# EAGLE design TLC5940Shield-v1 (EAGLE 6.5.0)
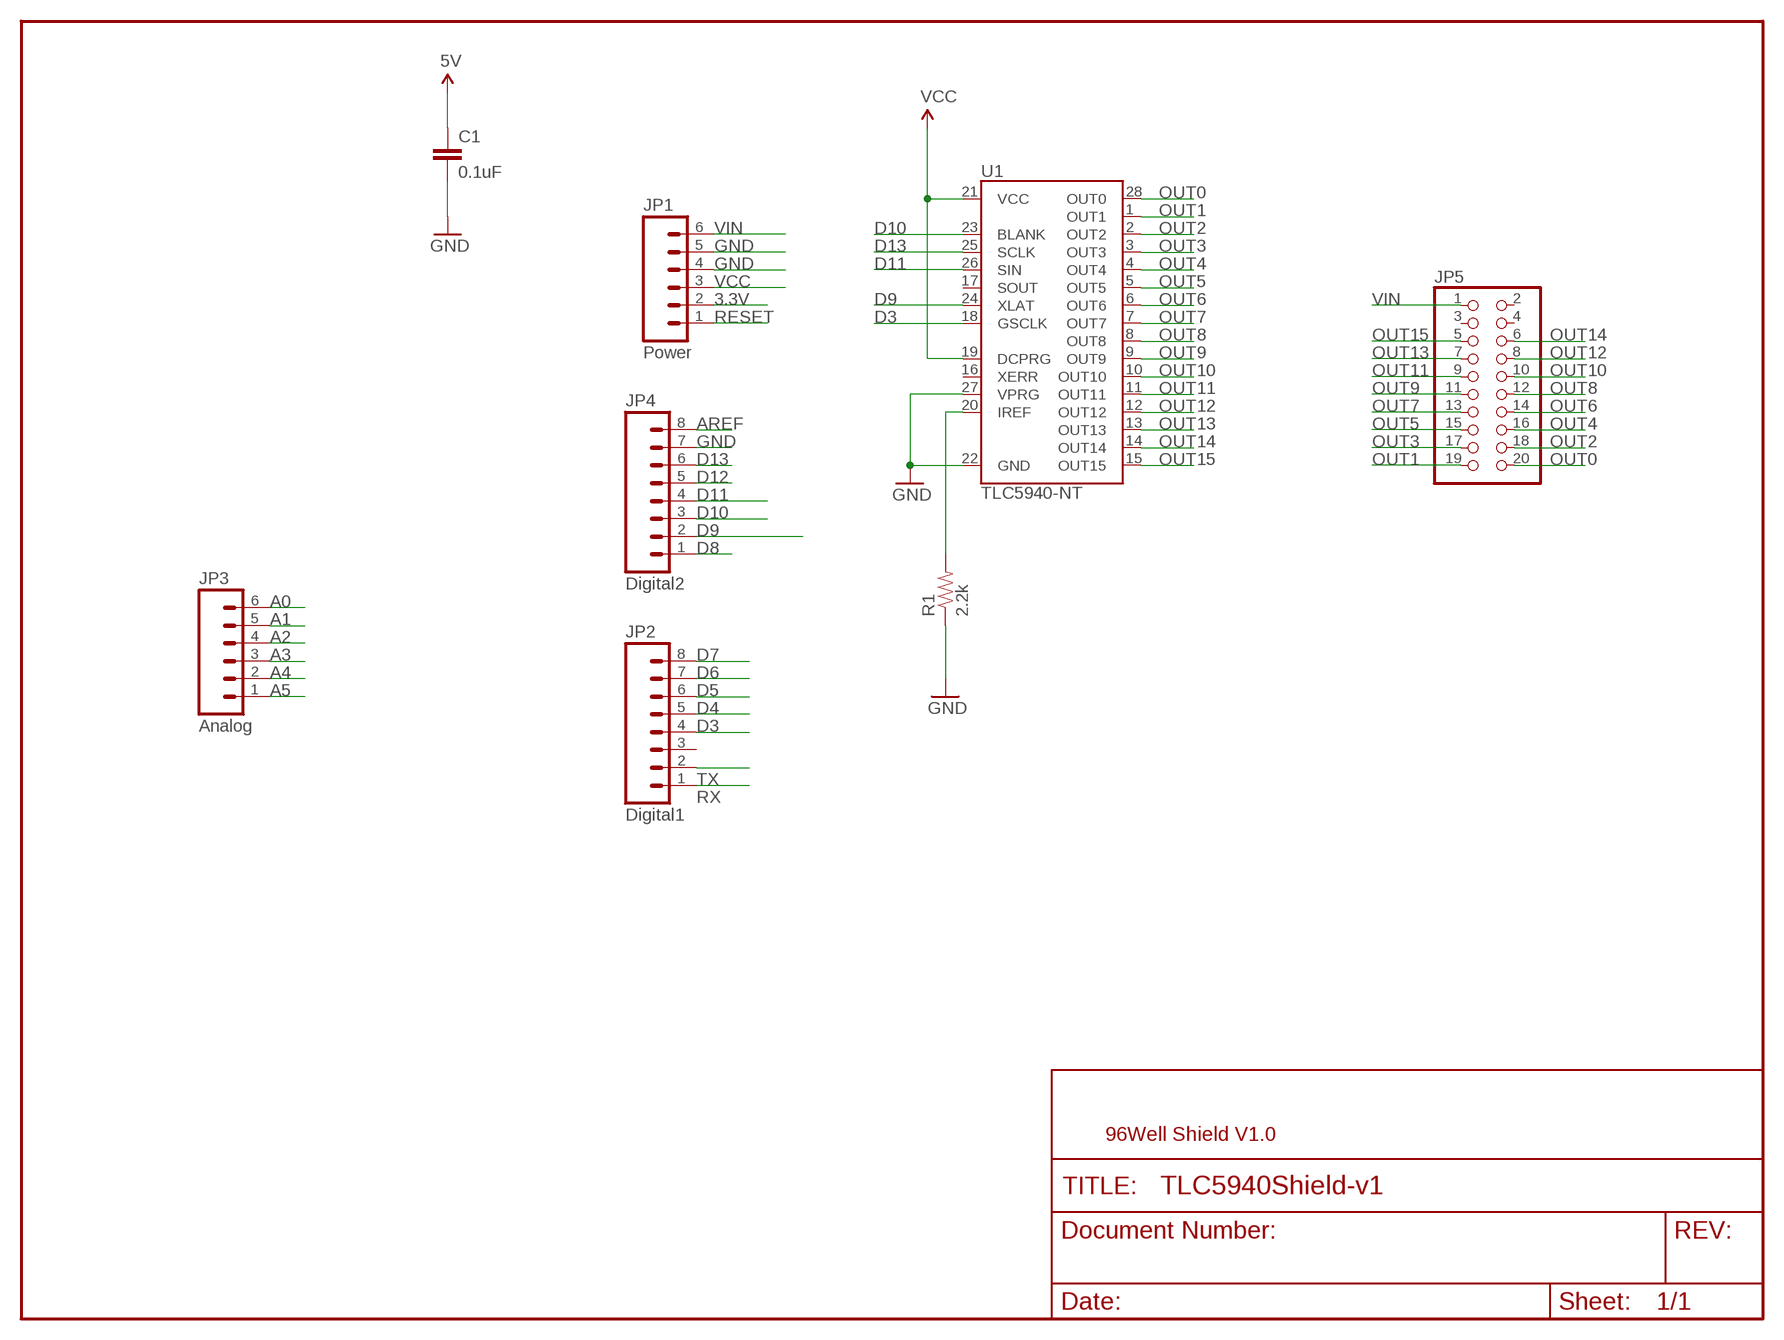
[diagram p0: schematic, sheet 1]

## Parts
C1  0.1uF  CAP0402-CAP  [0402-CAP]
JP1  Power  M06SIP  [1X06]
JP2  Digital1  M08  [1X08]
JP3  Analog  M06SIP  [1X06]
JP4  Digital2  M08  [1X08]
JP5  PINHD-2X10  [2X10]
R1  2.2k  RESISTORPTH-1/4W  [AXIAL-0.4]
U1  TLC5940-NT  [DIL28-3]

## Nets
3.3V: JP1.2
A0: JP3.6
A1: JP3.5
A2: JP3.4
A3: JP3.3
A4: JP3.2
A5: JP3.1
AREF: JP4.8
D3: JP2.4 U1.18(GSCLK)
D4: JP2.5
D5: JP2.6
D6: JP2.7
D7: JP2.8
D8: JP4.1
D9: JP4.2 U1.24(XLAT)
D10: JP4.3 U1.23(BLANK)
D11: JP4.4 U1.26(SIN)
D12: JP4.5
D13: JP4.6 U1.25(SCLK)
GND [power]: C1.2 JP1.4 JP1.5 JP4.7 R1.P$1 U1.22(GND) U1.27(VPRG)
N$183: R1.P$2 U1.20(IREF)
OUT0: JP5.20 U1.28(OUT0)
OUT1: JP5.19 U1.1(OUT1)
OUT2: JP5.18 U1.2(OUT2)
OUT3: JP5.17 U1.3(OUT3)
OUT4: JP5.16 U1.4(OUT4)
OUT5: JP5.15 U1.5(OUT5)
OUT6: JP5.14 U1.6(OUT6)
OUT7: JP5.13 U1.7(OUT7)
OUT8: JP5.12 U1.8(OUT8)
OUT9: JP5.11 U1.9(OUT9)
OUT10: JP5.10 U1.10(OUT10)
OUT11: JP5.9 U1.11(OUT11)
OUT12: JP5.8 U1.12(OUT12)
OUT13: JP5.7 U1.13(OUT13)
OUT14: JP5.6 U1.14(OUT14)
OUT15: JP5.5 U1.15(OUT15)
RESET: JP1.1
RX: JP2.1
TX: JP2.2
VCC [power]: C1.1 JP1.3 U1.19(DCPRG) U1.21(VCC) ; supply symbol labelled 5V
VIN [power]: JP1.6 JP5.1
Unconnected: JP2.3 JP5.2 JP5.3 JP5.4 U1.16(XERR) U1.17(SOUT)

## Notes on the sheet
- 96Well Shield V1.0

## Library data of the parts
C1 = SparkFun-Capacitors:CAP: Capacitor Standard 0603 ceramic capacitor, and 0.1" leaded capacitor.
JP1 JP3 = SparkFun:M06: Header 6 Standard 6-pin 0.1" header. Use with straight break away headers (SKU : PRT-00116), right angle break away headers (PRT-00553), swiss pins (PRT-00743), machine pins (PRT-00117), and female headers (PRT-00115). Molex polarized connector foot print use with SKU : PRT-08094 with associated crimp pins and housings. NOTES ON THE VARIANTS LOCK and LOCK_LONGPADS... This footprint was designed to help hold the alignment of a through-hole component (i.e. 6-pin header) while soldering it into place. You may notice that each hole has been shifted either up or down by 0.005 of an inch from it's more standard position (which is a perfectly straight line). This slight alteration caused the pins (the squares in the middle) to touch the edges of the holes. Because they are alternating, it causes a "brace" to hold the component in place. 0.005 has proven to be the perfect amount of "off-center" position when using our standard breakaway headers. Although looks a little odd when you look at the bare footprint, once you have a header in there, the alteration is very hard to notice. Also, if you push a header all the way into place, it is covered up entirely on the bottom side. This idea of altering the position of holes to aid alignment will be further integrated into the Sparkfun Library for other footprints. It can help hold any component with 3 or more connection pins.
JP2 JP4 = SparkFun:M08: Header 8 Standard 8-pin 0.1" header. Use with straight break away headers (SKU : PRT-00116), right angle break away headers (PRT-00553), swiss pins (PRT-00743), machine pins (PRT-00117), and female headers (PRT-00115).
JP5 = pinhead:PINHD-2X10: PIN HEADER
R1 = SparkFun-Resistors:RESISTOR: Resistor Basic schematic elements and footprints for 0603, 1206, and PTH resistors.
U1 = SparkFun-DigitalIC:TLC5940: 16-channel LED Driver with Dot Correction and Grayscale PWM Control The TLC5940 is a 16-channel, constant-current sink LED driver. Each channel has an individually adjustable 4096-step grayscale PWM brightness control and a 64-step, constant-current sink (dot correction). The dot correction adjusts the brightness variations between LED channels and other LED drivers. The dot correction data is stored in an integrated EEPROM. Both grayscale control and dot correction are accessible via a serial interface. A single external resistor sets the maximum current value of all 16 channels. Packages: 28-pin HTSSOP 32-pin 5x5mm QFN 28-pin DIP

## Net classes
1 power: width 0.254 mm

## Board
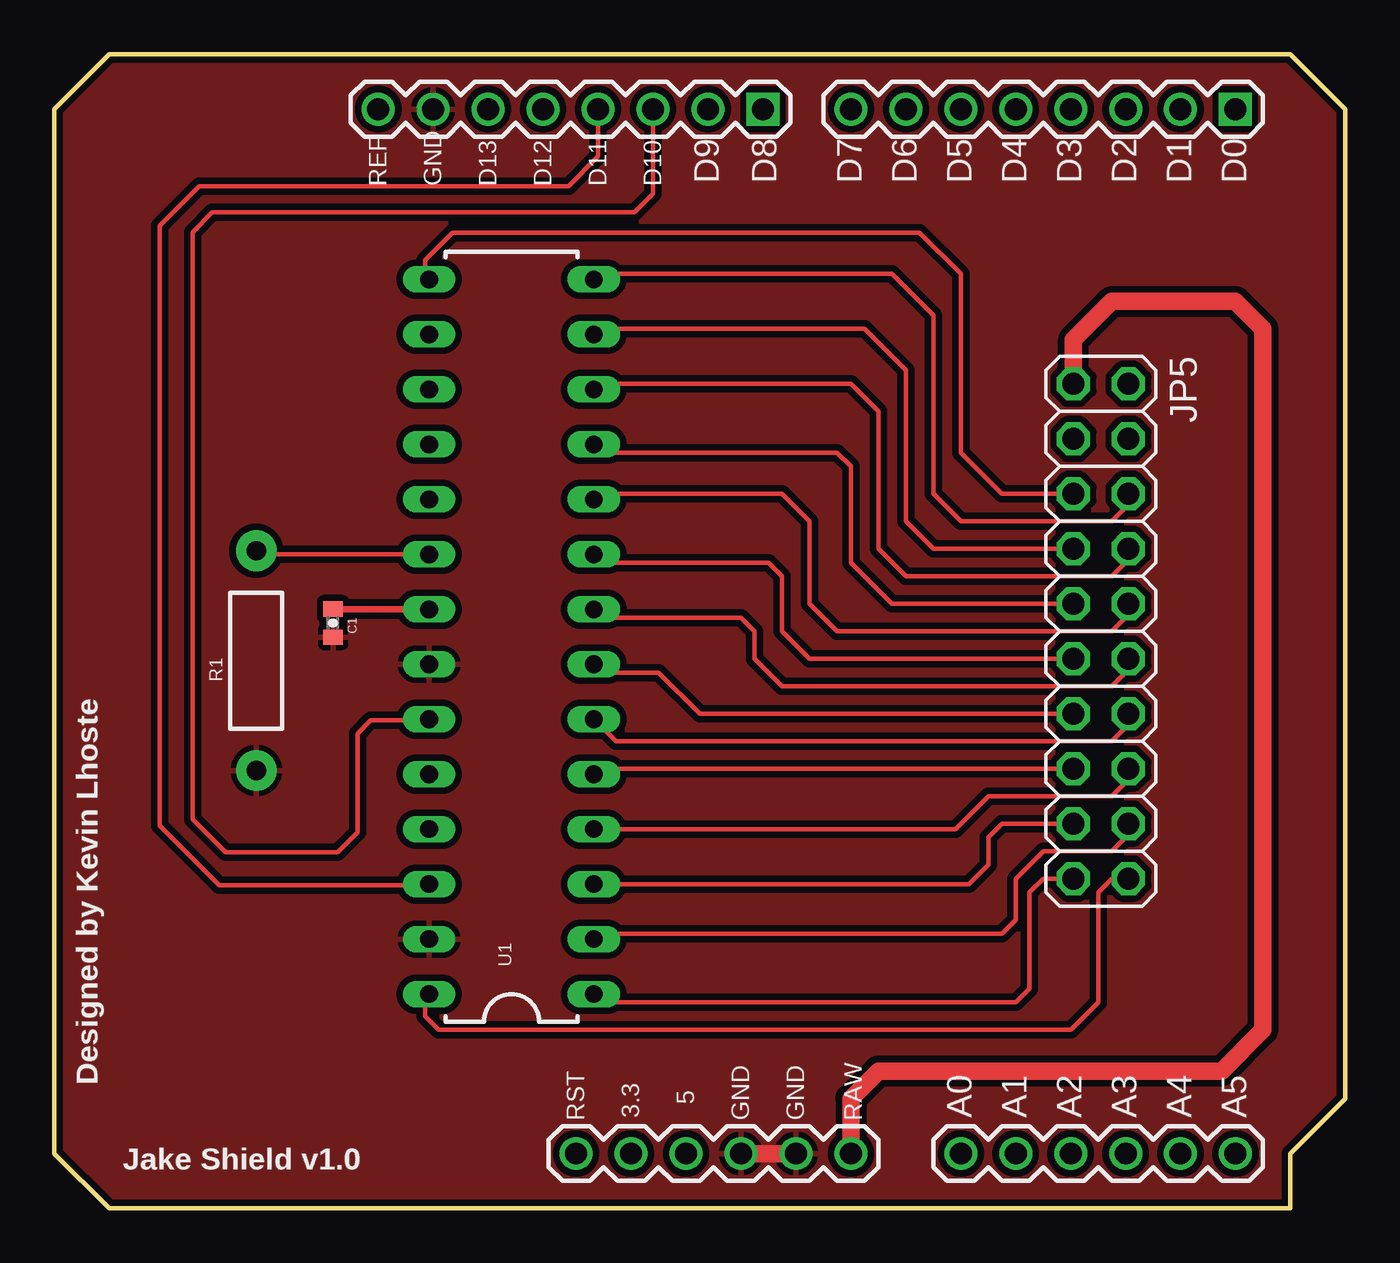
[diagram p1: board, top side]
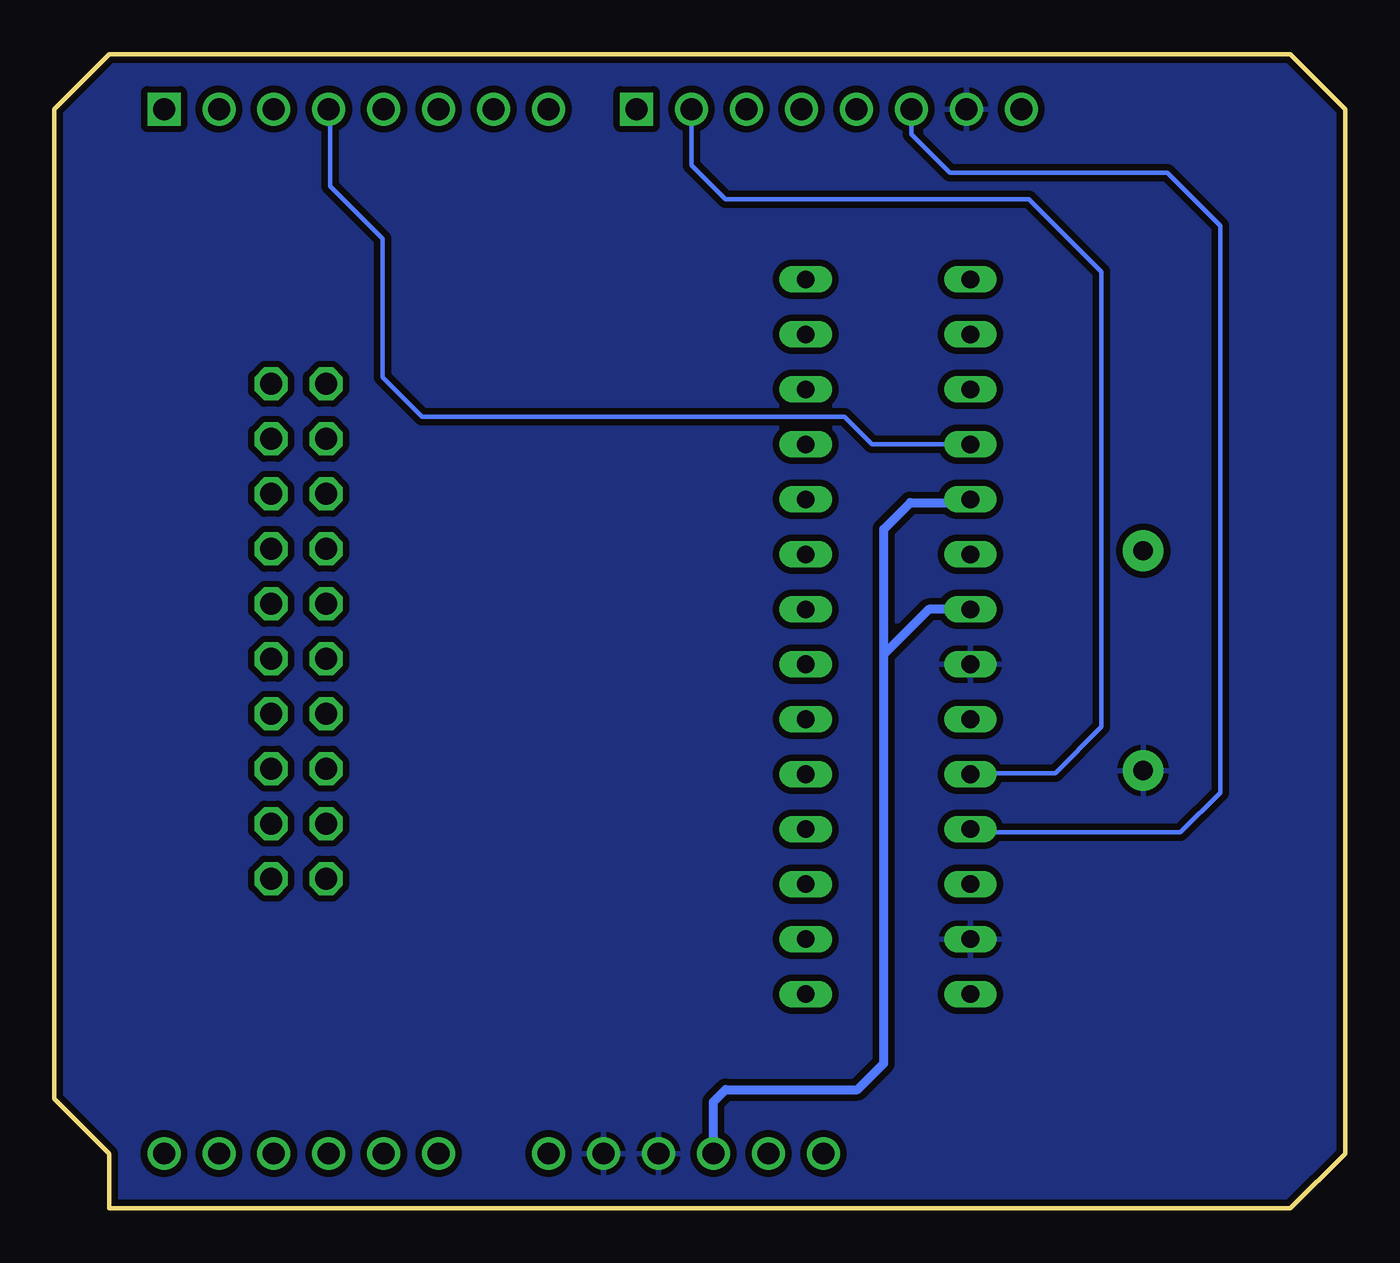
[diagram p2: board, bottom side, seen from below]

Size 59.69 x 53.34 mm. Coordinates in mm from the lower left corner, seen from the top.
Outline: 0,50.8 0,2.54 2.54,0 57.15,0 57.15,2.54 59.69,5.08 59.69,50.8 57.15,53.34 2.54,53.34 0,50.8
Copper layers (1*16): Top 0.035mm / dielectric 0.2mm / Bottom 0.035mm
Design rules "SeeedStudio_DRU_no_angle_20130527 *": minimum track width 6mil, minimum drill 12mil, track to track 6mil, track to pad 6mil, pad to pad 6mil, via to via 6mil, smd to smd 0mil, copper to edge 10mil, drill to drill 10mil, minimum pad ring 6mil, minimum via ring 6mil, stop-mask expansion 2mil, vias tented up to drill 25mil, thermal gap 10mil

### Footprints (pad centres in the part's own frame; a part is rotated, then mirrored left to right if it is on the bottom)
0402-CAP = smd 0.7 x 0.9: 1 -0.65,0; 2 0.65,0
1X06 = drill 1.016: 1 0,0; 2 2.54,0; 3 5.08,0; 4 7.62,0; 5 10.16,0; 6 12.7,0
1X08 = drill 1.016 square: 1 0,0 | drill 1.016: 2 2.54,0; 3 5.08,0; 4 7.62,0; 5 10.16,0; 6 12.7,0; 7 15.24,0; 8 17.78,0
2X10 = drill 1.016 octagon: 1 -11.43,-1.27; 2 -11.43,1.27; 3 -8.89,-1.27; 4 -8.89,1.27; 5 -6.35,-1.27; 6 -6.35,1.27; 7 -3.81,-1.27; 8 -3.81,1.27; 9 -1.27,-1.27; 10 -1.27,1.27; 11 1.27,-1.27; 12 1.27,1.27; 13 3.81,-1.27; 14 3.81,1.27; 15 6.35,-1.27; 16 6.35,1.27; 17 8.89,-1.27; 18 8.89,1.27; 19 11.43,-1.27; 20 11.43,1.27
AXIAL-0.4 = drill 0.9 pad 1.88: P$1 -5.08,0; P$2 5.08,0
DIL28-3 = drill 0.813 long: 1 -16.51,-3.81; 2 -13.97,-3.81; 3 -11.43,-3.81; 4 -8.89,-3.81; 5 -6.35,-3.81; 6 -3.81,-3.81; 7 -1.27,-3.81; 8 1.27,-3.81; 9 3.81,-3.81; 10 6.35,-3.81; 11 8.89,-3.81; 12 11.43,-3.81; 13 13.97,-3.81; 14 16.51,-3.81; 15 16.51,3.81; 16 13.97,3.81; 17 11.43,3.81; 18 8.89,3.81; 19 6.35,3.81; 20 3.81,3.81; 21 1.27,3.81; 22 -1.27,3.81; 23 -3.81,3.81; 24 -6.35,3.81; 25 -8.89,3.81; 26 -11.43,3.81; 27 -13.97,3.81; 28 -16.51,3.81

### Placement (x,y rotation side)
C1  12.89,27.05 270 top
JP1  24.13,2.54 0 top
JP2  54.61,50.8 180 top
JP3  54.61,2.54 180 top
JP4  32.77,50.8 180 top
JP5  48.39,26.67 270 top
R1  9.35,25.31 90 top
U1  21.15,26.42 90 top

### Tracks (layer width: path | path; a pad name or v marks a point on that pad's centre or on a via)
D3
  Bottom 0.203: U1.18 21.89,35.31 23.16,36.58 42.67,36.58 44.5,38.41 44.5,44.81 46.94,47.24 46.94,50.75 JP2.4
D9
  Bottom 0.203: JP4.2 30.23,48.21 28.65,46.63 14.63,46.63 11.28,43.28 11.28,22.25 13.41,20.12 17.29,20.12 U1.24
D10
  Top 0.203: JP4.3 27.69,46.89 26.82,46.02 7.32,46.02 6.4,45.11 6.4,17.98 7.92,16.46 13.11,16.46 14.02,17.37 14.02,21.95 14.63,22.55 17.29,22.55 U1.23
D11
  Top 0.203: JP4.4 25.15,48.62 23.77,47.24 6.71,47.24 4.88,45.41 4.88,17.68 7.62,14.94 17.29,14.94 U1.26
D13
  Bottom 0.203: JP4.6 20.07,49.63 18.29,47.85 8.23,47.85 5.79,45.41 5.79,19.2 7.62,17.37 17.18,17.37 U1.25
GND
  Top 0.813: JP1.4 JP1.5
  pour Bottom (isolate 0.305): 64.77,53.34 64.77,0 0,0 0,53.34
  pour Top (isolate 0.305): 64.77,53.34 64.77,0 0,0 0,53.34
N$183
  Top 0.203: U1.20 9.51,30.23 R1.P$2
OUT0
  Top 0.203: JP5.20 48.9,15.24 48.26,14.61 48.26,9.53 46.99,8.26 17.78,8.26 17.14,8.89 17.14,9.72 U1.28
OUT1
  Top 0.203: JP5.19 45.72,15.24 45.09,14.61 45.09,10.16 44.45,9.53 25.34,9.53 U1.1
OUT2
  Top 0.203: JP5.18 49.66,17.27 48.9,16.51 45.72,16.51 44.45,15.24 44.45,13.34 43.81,12.7 25.21,12.7 U1.2
OUT3
  Top 0.203: U1.3 42.29,14.99 43.18,15.88 43.18,17.14 43.81,17.78 JP5.17
OUT4
  Top 0.203: U1.4 41.66,17.53 43.18,19.05 48.9,19.05 49.53,19.68 49.53,20.19 JP5.16
OUT5
  Top 0.203: JP5.15 25.21,20.32 U1.5
OUT6
  Top 0.203: JP5.14 49.66,22.35 48.9,21.59 25.97,21.59 U1.6
OUT7
  Top 0.203: JP5.13 29.84,22.86 27.94,24.77 25.34,24.77 U1.7
OUT8
  Top 0.203: JP5.12 49.66,24.89 48.9,24.13 33.66,24.13 32.38,25.4 32.38,26.67 31.75,27.3 25.34,27.3 U1.8
OUT9
  Top 0.203: JP5.11 34.92,25.4 33.66,26.67 33.66,29.21 33.02,29.84 25.34,29.84 U1.9
OUT10
  Top 0.203: JP5.10 49.66,27.43 48.9,26.67 36.2,26.67 34.92,27.94 34.92,31.75 33.66,33.02 25.21,33.02 U1.10
OUT11
  Top 0.203: JP5.9 38.73,27.94 36.83,29.84 36.83,34.29 36.2,34.92 25.34,34.92 U1.11
OUT12
  Top 0.203: JP5.8 49.66,29.97 48.9,29.21 39.37,29.21 38.1,30.48 38.1,36.83 36.83,38.1 25.21,38.1 U1.12
OUT13
  Top 0.203: JP5.7 40.64,30.48 39.37,31.75 39.37,38.73 37.47,40.64 25.21,40.64 U1.13
OUT14
  Top 0.203: JP5.6 49.66,32.51 48.9,31.75 41.91,31.75 40.64,33.02 40.64,41.27 38.73,43.18 25.21,43.18 U1.14
OUT15
  Top 0.203: JP5.5 43.81,33.02 41.91,34.92 41.91,43.18 40.01,45.09 18.41,45.09 17.14,43.81 17.14,43.12 U1.15
VCC
  Top 0.305: U1.21 12.89,27.69 C1.1
  Bottom 0.406: JP1.3 29.21,4.93 28.65,5.49 22.55,5.49 21.34,6.71 21.34,25.6 | 21.34,25.6 21.34,31.39 20.12,32.61 17.49,32.61 U1.19 | U1.21 19.25,27.69 21.34,25.6
VIN
  Top 0.813: JP5.1 47.12,40.13 48.9,41.91 54.61,41.91 55.88,40.64 55.88,8.26 53.98,6.35 38.1,6.35 36.83,5.08 JP1.6

### Text on the board
tPlace: REF | GND | D13 | D12 | D11 | D10 | D9 | D8 | D7 | D6 | D5 | D4 | D3 | D2 | D1 | D0 | Designed by Kevin Lhoste | 5 | RST | 3.3 | GND | GND | RAW | A0 | A1 | A2 | A3 | A4 | A5 | Jake Shield v1.0